# Altium schematic sheet logic_lcd.SchDoc: mcHF Pro Transceiver UI board
size A3; Author: Krassi Atanassov; CompanyName: MØNKA; Engineer: For radio amateurs experimentation, non-commercial use only. Thank you!; Revision: 0.8.2; SheetTotal: 18
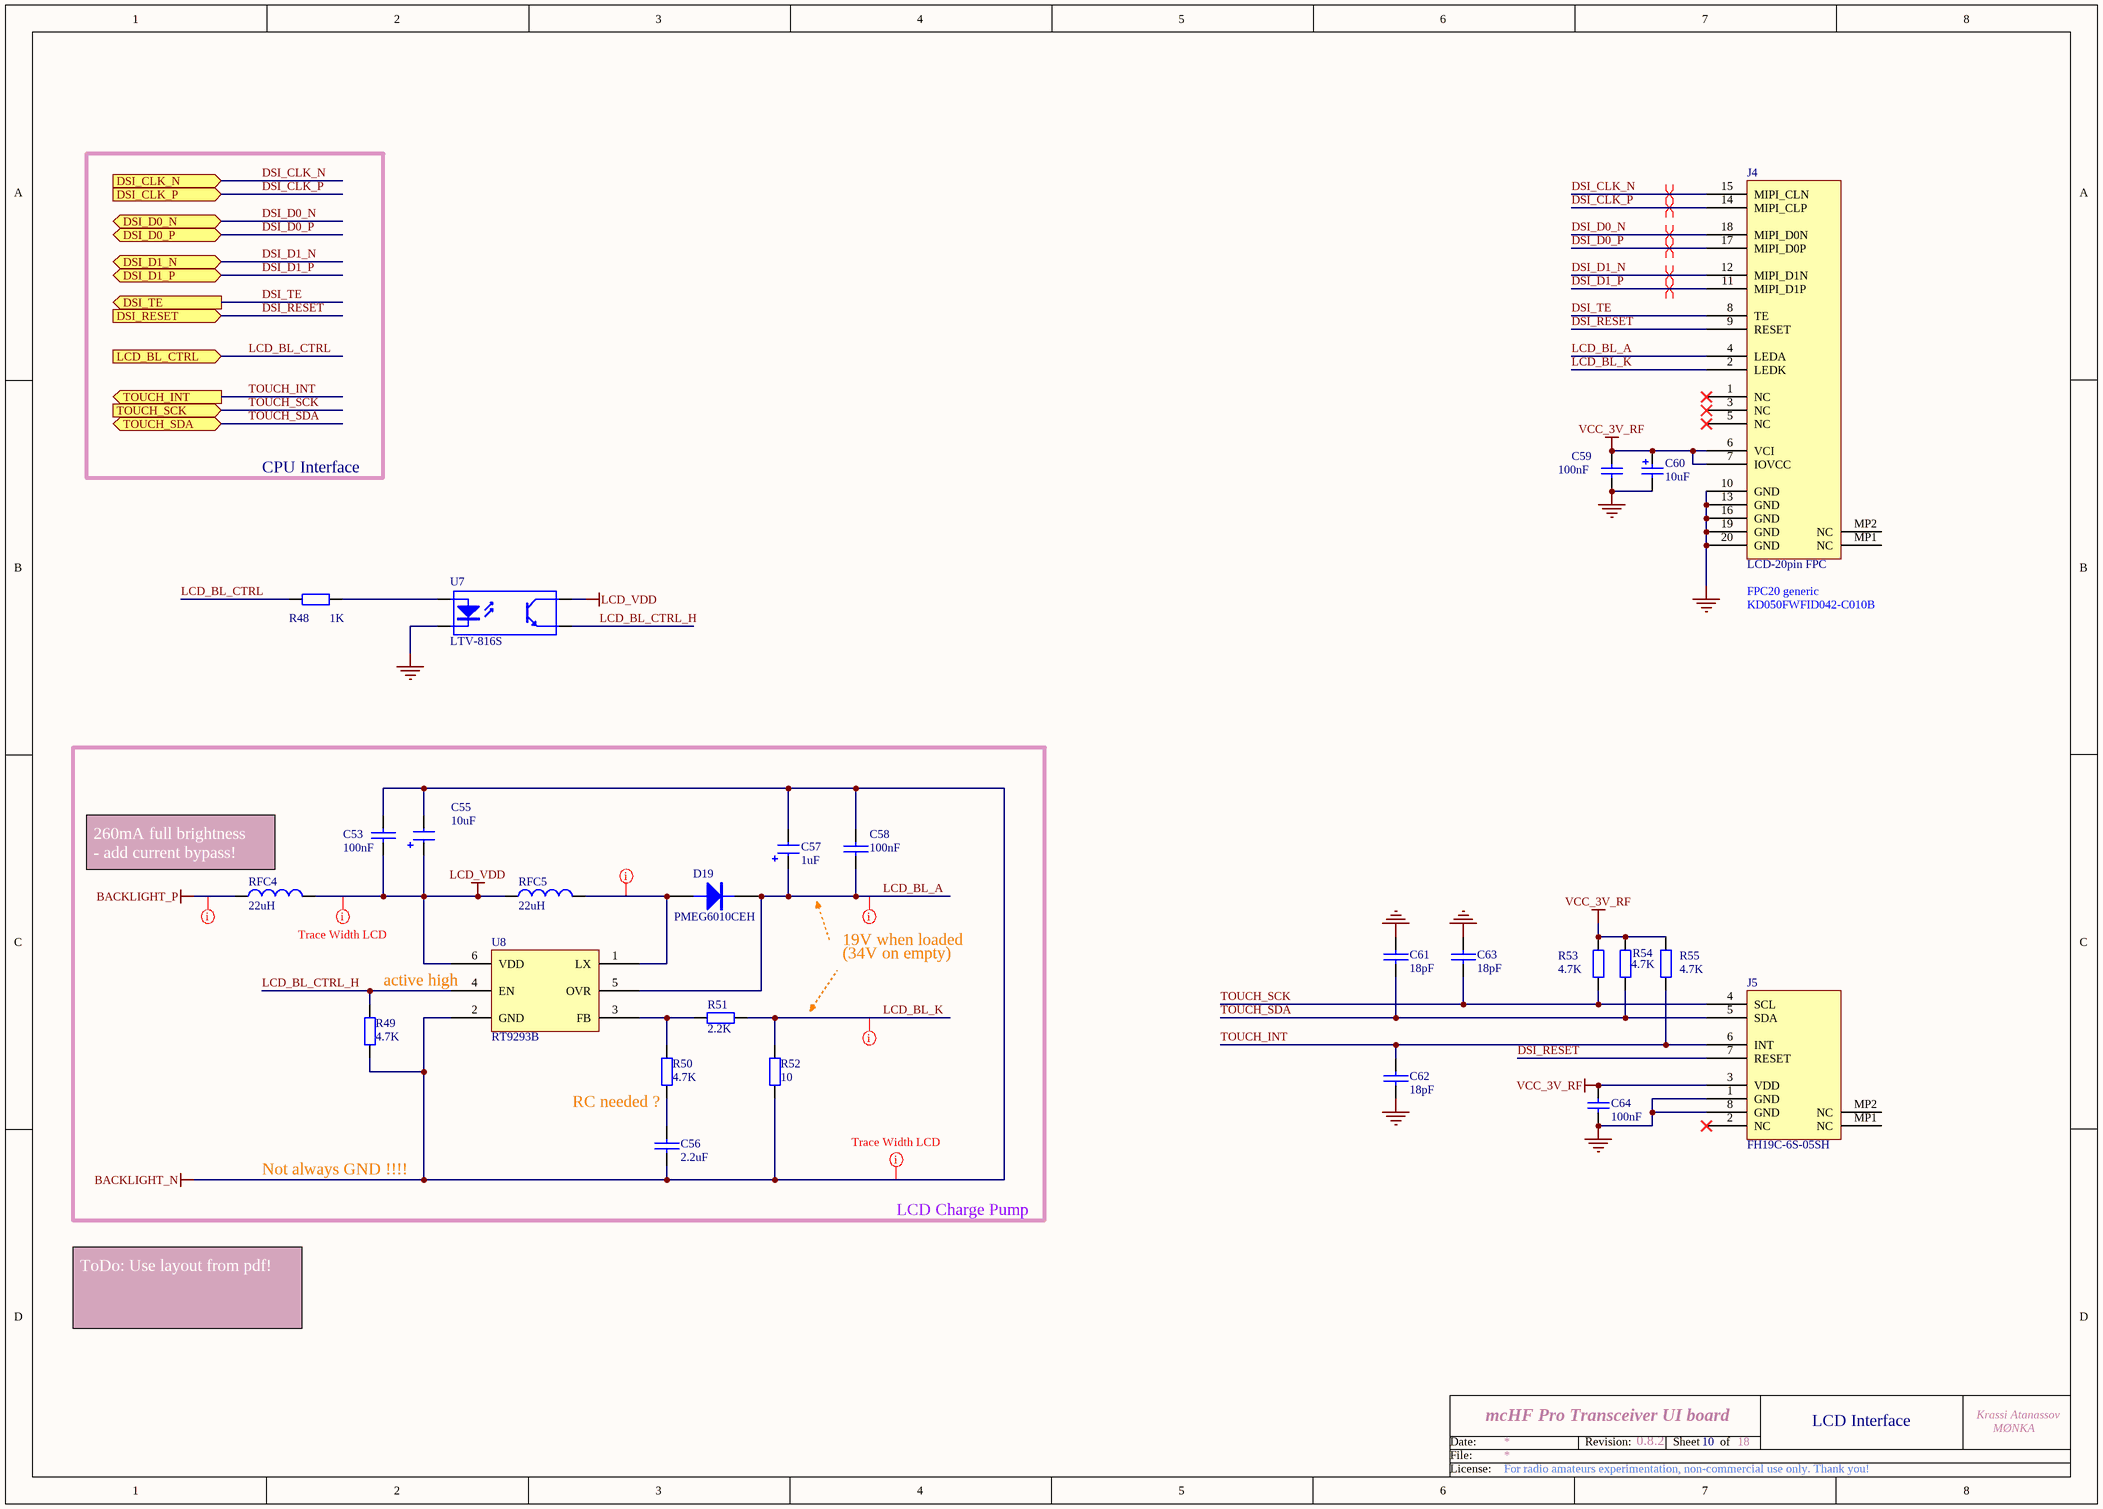
[diagram p0: logic_lcd.SchDoc]

## Parts
C53  100nF  [0805]
C55  10uF  [1206_Elec_Cap]
C56  2.2uF  [0805]
C57  1uF  [1206_Elec_Cap]
C58  100nF  [0805]
C59  100nF  [0805]
C60  10uF  [1206_Elec_Cap]
C61  18pF  [0805]
C62  18pF  [0805]
C63  18pF  [0805]
C64  100nF  [0805]
D19  PMEG6010CEH  [SOD87]
J4  LCD-20pin FPC  [MOLX-52746-2071]
J5  FH19C-6S-05SH  [MOLX-501461-0891]
R48  1K  [0805]
R49  4.7K  [0805]
R50  4.7K  [0805]
R51  2.2K  [0805]
R52  10  [1206]
R53  4.7K  [0805]
R54  4.7K  [0805]
R55  4.7K  [0805]
RFC4  22uH  [0805]
RFC5  22uH  [0805]
U7  LTV-816S  [SMDIP-4_new1]
U8  RT9293B  [SOT25-6]

## Ports
DSI_CLK_N (in), DSI_CLK_P (in), DSI_D0_N (bidir), DSI_D0_P (bidir), DSI_D1_N (bidir), DSI_D1_P (bidir), DSI_RESET (in), DSI_TE (out), LCD_BL_CTRL (in), TOUCH_INT (out), TOUCH_SCK (in), TOUCH_SDA (bidir)

## Nets
BACKLIGHT_N: C53.1 C55.2 C56.2 C57.2 C58.1 R49.1 R52.1 U8.2(GND)
BACKLIGHT_P: RFC4.1
GND: C59.1 C60.2 C61.1 C62.2 C63.1 C64.1 J4.10(GND) J4.13(GND) J4.16(GND) J4.19(GND) J4.20(GND) J5.1(GND) J5.8(GND) U7.2(K)
LCD_VDD: C53.2 C55.1 RFC4.2 RFC5.1 U7.4(C) U8.6(VDD)
VCC_3V_RF: C59.2 C60.1 C64.2 J4.6(VCI) J4.7(IOVCC) J5.3(VDD) R53.1 R54.1 R55.1
DSI_CLK_N: J4.15(MIPI_CLN) ; port DSI_CLK_N
DSI_CLK_P: J4.14(MIPI_CLP) ; port DSI_CLK_P
DSI_D0_N: J4.18(MIPI_D0N) ; port DSI_D0_N
DSI_D0_P: J4.17(MIPI_D0P) ; port DSI_D0_P
DSI_D1_N: J4.12(MIPI_D1N) ; port DSI_D1_N
DSI_D1_P: J4.11(MIPI_D1P) ; port DSI_D1_P
DSI_RESET: J4.9(RESET) J5.7(RESET) ; port DSI_RESET
DSI_TE: J4.8(TE) ; port DSI_TE
LCD_BL_A: C57.1 C58.2 D19.2(K) J4.4(LEDA) U8.5(OVR)
LCD_BL_CTRL: R48.1 ; port LCD_BL_CTRL
LCD_BL_CTRL_H: R49.2 U7.3(E) U8.4(EN)
LCD_BL_K: J4.2(LEDK) R51.2 R52.2
TOUCH_INT: C62.1 J5.6(INT) R55.2 ; port TOUCH_INT
TOUCH_SCK: C63.2 J5.4(SCL) R53.2 ; port TOUCH_SCK
TOUCH_SDA: C61.2 J5.5(SDA) R54.2 ; port TOUCH_SDA
NetC56_1: C56.1 R50.1
NetD19_1: D19.1(A) RFC5.2 U8.1(LX)
NetR48_2: R48.2 U7.1(A)
NetR50_2: R50.2 R51.1 U8.3(FB)

Not connected (* = marked no-connect by the designer): J4 1(NC)* 3(NC)* 5(NC)* MP1(NC) MP2(NC); J5 2(NC)* MP1(NC) MP2(NC)

## Layout directives
rule Width Constraint [Pref Width = 20mil    Min Width = 20mil    Max Width = 20mil]: BACKLIGHT_N, BACKLIGHT_P, LCD_VDD
rule Width Constraint [Pref Width = 15mil    Min Width = 15mil    Max Width = 15mil]: NetD19_1
rule Width Constraint [Pref Width = 10mil    Min Width = 10mil    Max Width = 10mil]: LCD_BL_A, LCD_BL_K
differential pair: DSI_CLK_N, DSI_CLK_P, DSI_D0_N, DSI_D0_P, DSI_D1_N, DSI_D1_P

## Notes on the sheet
- CPU Interface
- KD050FWFID042-C010B
- (near J4) FPC20 generic
- (near RFC4) 260mA full brightness     - add current bypass!
- (near U8) active high
- 19V when loaded
- (34V on empty)
- (near R50) RC needed ?
- Not always GND !!!!
- LCD Charge Pump
- ToDo: Use layout from pdf!
- 10
- LCD Interface
- Date:
- File:
- Revision:
- Sheet
- of
- License:

## Library data of the parts
C53 C58 = CAP: Capacitor; Order: FN 282-1264; QT Order: QCC-00157; Price: 0.089
C55 = CAP-POL: Electrolitic capacitor; Order: FN 145-7414; QT Order: QCC-00166; Price: 0.30
C56 = CAP: Ceramic Capacitor; Order: FN 175-9477; QT Order: QCC-00447; Price: 0.114
C57 = CAP-POL: Electrolitic capacitor; Order: FN 145-7406; QT Order: QCC-00172; Voltage: 50V; Price: 0.235
C59 C64 = CAP: Capacitor; Value: 100pF; Published: 8-Jun-2000; Revision: July-2002: Re-released for DXP Platform.; Publisher: Altium Limited
C60 = Cap Pol1: Published: 8-Jun-2000; Revision: July-2002: Re-released for DXP Platform.; Publisher: Altium Limited
C61-C63 = CAP: Capacitor; Notes: COG/NPO; Voltage: 100V
D19 = PMEG6010CEH: DIODE, SCHOTTKY, 1A, 60V, SOD-123F; Order: FN 151-0694; QT Order: QCD-00034; QT Price: 0.08; Price: 0.262
J4 = KD050FWFID042-C010B: LCD-20pin FPC, Top contacts position; Order: FN 3215802; Notes: FPC Board Connector, 0.5 mm, 20 Contacts, Receptacle, Top contacts position!
J5 = FPC8: 8 pin FPC, Top contacts position; Order: FN 2614916; Notes: FPC Board Connector, 0.5 mm, 8 Contacts, Receptacle,Top contact position
R48 = RES: Resistor; Order: FN 157-6459; QT Order: QCR-00326; Price: 0.061
R49 R50 R53-R55 = RES: Resistor; Order: FN 200-8383; QT Order: QCR-00341
  R49 R50: Price: 0.03
  R53-R55: Price: 0.024
R51 = RES: Resistor; Order: FN 188-7289; QT Order: QCR-00333; QT Price: 0.03; Price: 0.075
R52 = RES: Resistor; Order: FN 207-3875; QT Order: QCR-00419; QT Price: 0.03; Notes: What is the biggest power rating to fit into 1206 ?; Price: 0.024
RFC4 = Inductor: Power Inductor; QT Order: QCL-00097; QT Price: 0.085; Notes: Don't we already have selection for 0.8.0(bigger than 0805) ?; Price: 0
RFC5 = Inductor: Power Inductor; QT Order: QCL-00097; QT Price: 0.085; Price: 0
U7 = ISP817XSM: OPTOCOUPLER, SMDIP-4, TR O/P; Order: FN 168-3292; Notes: v 0.6 RF board opto can do, but more expensive; Price: 0.26
U8 = RT9293B: Charge Pump; Order: Hotmcu.com; QT Order: QCI-01775; QT Price: 0.27; Notes: Originally from Thomas, if not Ali; Price: 0.5